# EAGLE design ver11 (EAGLE 6.4)
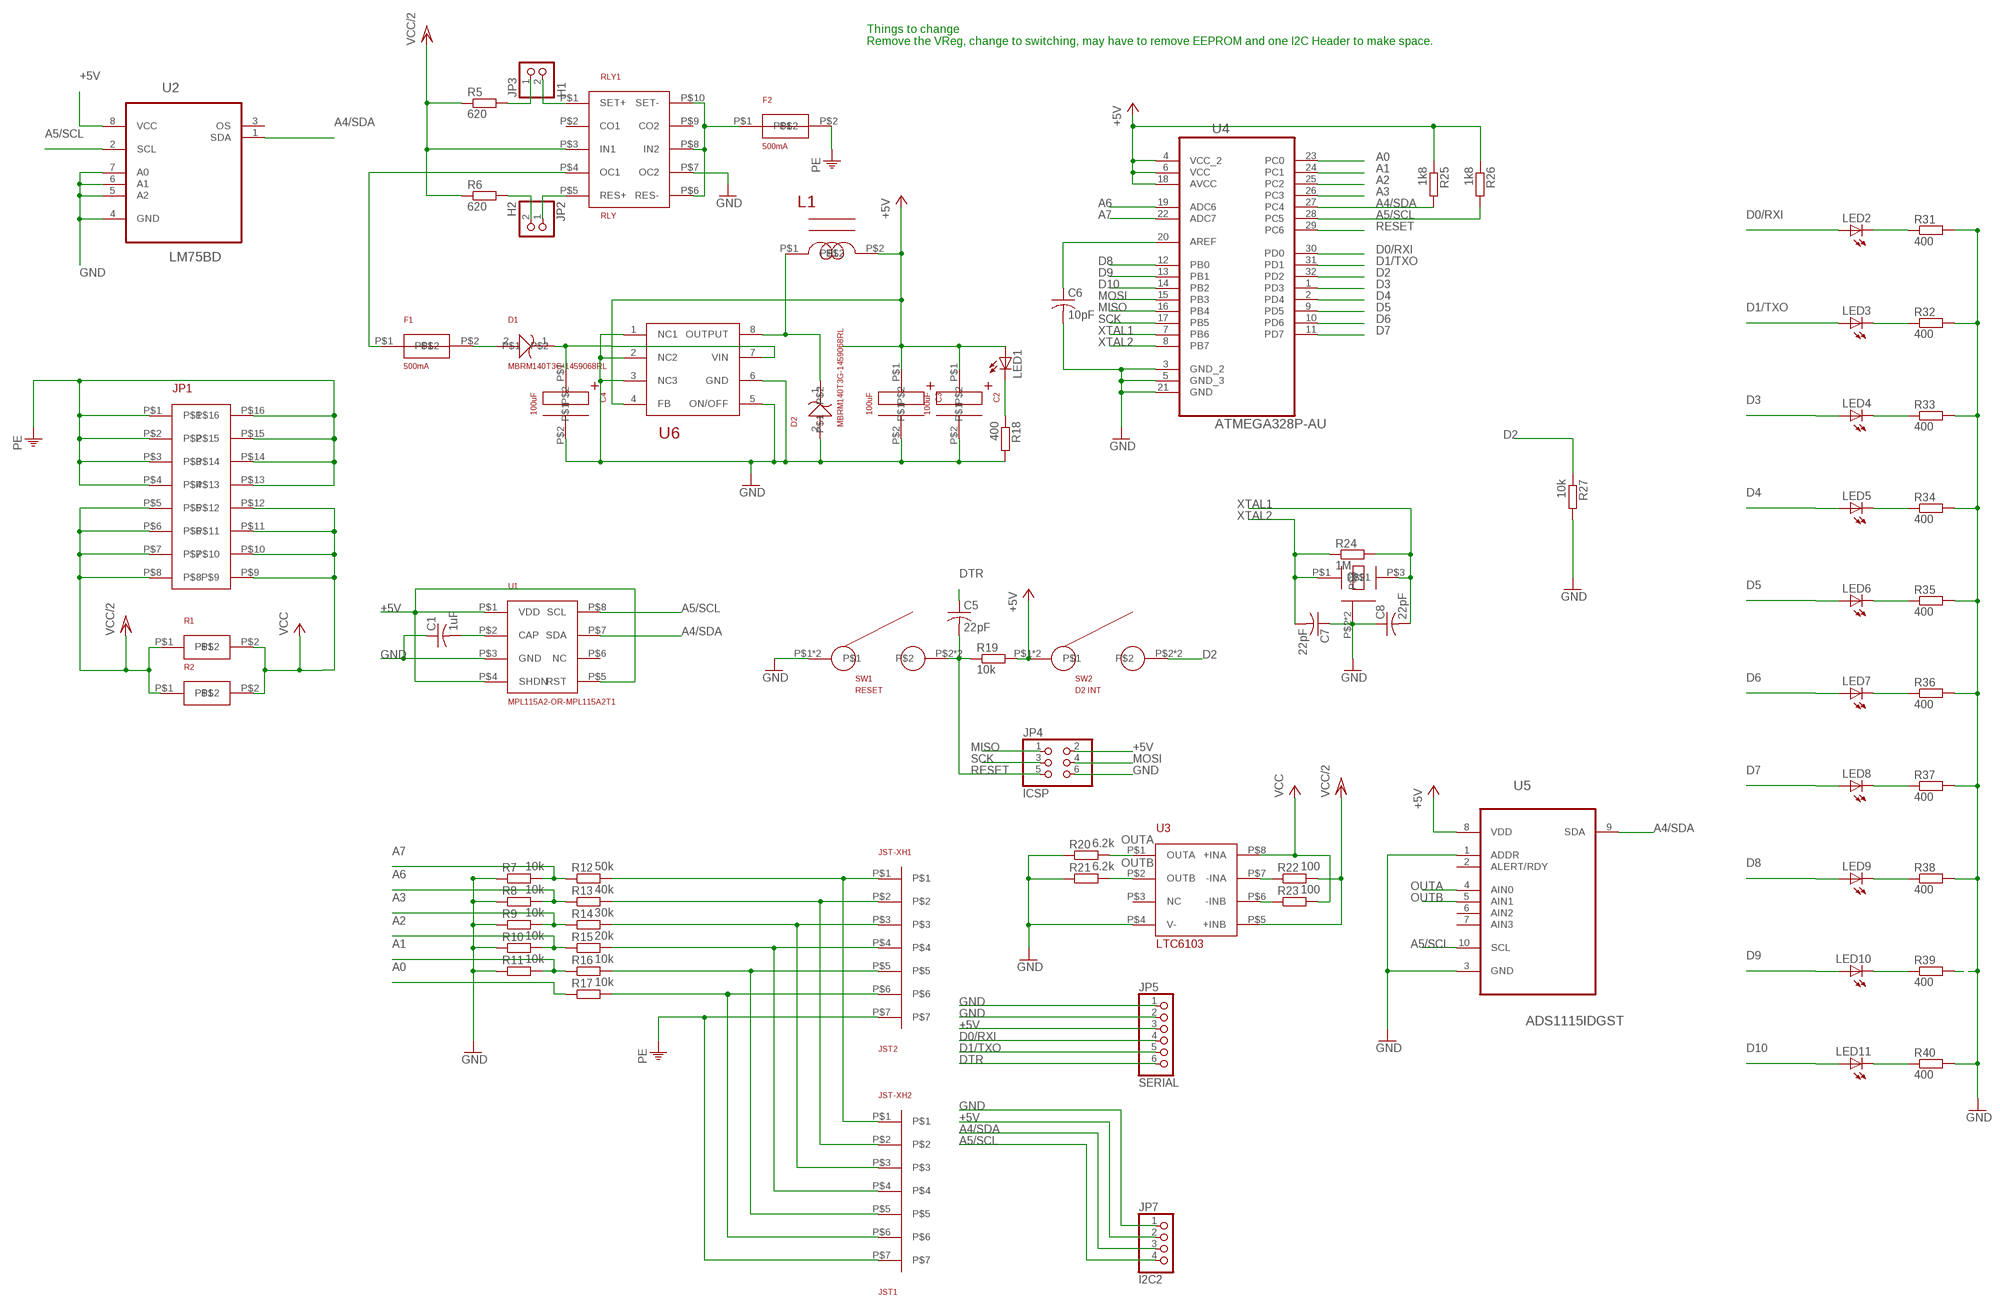
[diagram p0: schematic, sheet 1]

## Parts
C1  1uF  C-USC1206  [C1206]
C2  100uF  EEEFTH101XAP  [EEEFTH101XAP]
C3  100uF  EEEFTH101XAP  [EEEFTH101XAP]
C4  100uF  EEEFTH101XAP  [EEEFTH101XAP]
C5  22pF  C-USC1206  [C1206]
C6  10pF  C-USC1206  [C1206]
C7  22pF  C-USC1206  [C1206]
C8  22pF  C-USC1206  [C1206]
D1  MBRM140T3G-1459068RL  [MBRM140T3G-1459068RL]
D2  MBRM140T3G-1459068RL  [MBRM140T3G-1459068RL]
F1  500mA  MF-MSMF050-2  [MF-MSMF050-2]
F2  500mA  0154.500DR-FUSE-0453.500  [0154.500DR-FUSE-0453.500]
JP1  39-29-1167-MOLEX  [39-29-1167-MOLEX]
JP2  H2  PINHD-1X2  [1X02]
JP3  H1  PINHD-1X2  [1X02]
JP4  ICSP  PINHD-2X3  [2X03]
JP5  SERIAL  PINHD-1X6  [1X06]
JP7  I2C2  PINHD-1X4  [1X04]
JST-XH1  JST2  JSTXH-7PIN  [JSTXH-7PIN]
JST-XH2  JST1  JSTXH-7PIN  [JSTXH-7PIN]
L1  MCSD75-121KU-120UF-INDUCTOR-660MA-1864147  [MCSD75-121KU-120UF-INDUCTOR-660MA-1864147]
LED1  LED1206  [LED-1206]
LED2  LED1206  [LED-1206]
LED3  LED1206  [LED-1206]
LED4  LED1206  [LED-1206]
LED5  LED1206  [LED-1206]
LED6  LED1206  [LED-1206]
LED7  LED1206  [LED-1206]
LED8  LED1206  [LED-1206]
LED9  LED1206  [LED-1206]
LED10  LED1206  [LED-1206]
LED11  LED1206  [LED-1206]
R1  OARSXPR002FLF  [OARSXPR002FLF]
R2  OARSXPR002FLF  [OARSXPR002FLF]
R5  620  R-EU_R1206  [R1206]
R6  620  R-EU_R1206  [R1206]
R7  10k  R-EU_R1206  [R1206]
R8  10k  R-EU_R1206  [R1206]
R9  10k  R-EU_R1206  [R1206]
R10  10k  R-EU_R1206  [R1206]
R11  10k  R-EU_R1206  [R1206]
R12  50k  R-EU_R1206  [R1206]
R13  40k  R-EU_R1206  [R1206]
R14  30k  R-EU_R1206  [R1206]
R15  20k  R-EU_R1206  [R1206]
R16  10k  R-EU_R1206  [R1206]
R17  10k  R-EU_R1206  [R1206]
R18  400  R-EU_R1206  [R1206]
R19  10k  R-EU_R1206  [R1206]
R20  6.2k  R-EU_R1206  [R1206]
R21  6.2k  R-EU_R1206  [R1206]
R22  100  R-EU_R1206  [R1206]
R23  100  R-EU_R1206  [R1206]
R24  1M  R-EU_R1206  [R1206]
R25  1k8  R-EU_R1206  [R1206]
R26  1k8  R-EU_R1206  [R1206]
R27  10k  R-EU_R1206  [R1206]
R31  400  R-EU_R1206  [R1206]
R32  400  R-EU_R1206  [R1206]
R33  400  R-EU_R1206  [R1206]
R34  400  R-EU_R1206  [R1206]
R35  400  R-EU_R1206  [R1206]
R36  400  R-EU_R1206  [R1206]
R37  400  R-EU_R1206  [R1206]
R38  400  R-EU_R1206  [R1206]
R39  400  R-EU_R1206  [R1206]
R40  400  R-EU_R1206  [R1206]
RLY1  RLY  3-1393788-3  [3-1393788-3]
SW1  RESET  MC32829  [MC32829]
SW2  D2 INT  MC32829  [MC32829]
U1  MPL115A2-OR-MPL115A2T1  [MPL115A2-OR-MPL115A2T1]
U2  LM75BD  [SOIC127P600X175-8N]
U3  LTC6103  LTC6103CMS8#PBF  [LTC6103CMS8#PBF]
U4  ATMEGA328P-AU  [QFP80P900X900X120-32N]
U5  ADS1115IDGST  [SOP50P490X110-10N]
U6  VOLTREG-LM2594MX-5.0/NOPB-1496090  [SO08]
XT1  ABMM2-16.000MHZ-E2-T  [ABMM2-16.000MHZ-E2-T]

## Nets
+5V: C2.P$1 C3.P$1 JP4.2 JP5.3 JP7.2 L1.P$2 LED1.A R19.2 R25.1 R26.1 SW2.P$1 SW2.P$4 U1.P$1(VDD) U1.P$4(SHDN) U1.P$5(RST) U2.8(VCC) U4.4(VCC_2) U4.6(VCC) U4.18(AVCC) U5.8(VDD) U6.4(FB)
A0: R17.1 U4.23(PC0)
A1: R11.2 R16.1 U4.24(PC1)
A2: R10.2 R15.1 U4.25(PC2)
A3: R9.2 R14.1 U4.26(PC3)
A4/SDA: JP7.3 R25.2 U1.P$7(SDA) U2.1(SDA) U4.27(PC4) U5.9(SDA)
A5/SCL: JP7.4 R26.2 U1.P$8(SCL) U2.2(SCL) U4.28(PC5) U5.10(SCL)
A6: R8.2 R13.1 U4.19(ADC6)
A7: R7.2 R12.1 U4.22(ADC7)
D0/RXI: JP5.4 LED2.A U4.30(PD0)
D1/TXO: JP5.5 LED3.A U4.31(PD1)
D2: R27.1 SW2.P$2 SW2.P$3 U4.32(PD2)
D3: LED4.A U4.1(PD3)
D4: LED5.A U4.2(PD4)
D5: LED6.A U4.9(PD5)
D6: LED7.A U4.10(PD6)
D7: LED8.A U4.11(PD7)
D8: LED9.A U4.12(PB0)
D9: LED10.A U4.13(PB1)
D10: LED11.A U4.14(PB2)
DTR: C5.1 JP5.6
GND: C1.1 C2.P$2 C3.P$2 C4.P$2 C6.2 C7.1 C8.1 D2.2 JP4.6 JP5.1 JP5.2 JP7.1 R7.1 R8.1 R9.1 R10.1 R11.1 R18.2 R20.1 R21.1 R27.2 R31.2 R32.2 R33.2 R34.2 R35.2 R36.2 R37.2 R38.2 R39.2 R40.2 RLY1.P$7(OC2) SW1.P$1 SW1.P$4 U1.P$3(GND) U2.4(GND) U2.5(A2) U2.6(A1) U2.7(A0) U3.P$4(V-) U4.3(GND_2) U4.5(GND_3) U4.21(GND) U5.1(ADDR) U5.3(GND) U6.1(NC1) U6.2(NC2) U6.3(NC3) U6.5(ON/OFF) U6.6(GND) XT1.P$2 XT1.P$4
MISO: JP4.1 U4.16(PB4)
MOSI: JP4.4 U4.15(PB3)
N$1: F1.P$1 RLY1.P$4(OC1)
N$2: C4.P$1 D1.1 U6.7(VIN)
N$3: D1.2 F1.P$2
N$4: LED1.C R18.1
N$5: JP3.1 R5.2
N$6: JP3.2 RLY1.P$1(SET+)
N$7: LED2.C R31.1
N$9: LED3.C R32.1
N$10: LED4.C R33.1
N$11: LED5.C R34.1
N$12: LED6.C R35.1
N$13: LED7.C R36.1
N$14: LED8.C R37.1
N$15: LED9.C R38.1
N$16: LED10.C R39.1
N$17: LED11.C R40.1
N$18: JST-XH1.P$1 JST-XH2.P$1 R12.2
N$19: JST-XH1.P$2 JST-XH2.P$2 R13.2
N$20: JST-XH1.P$3 JST-XH2.P$3 R14.2
N$21: JST-XH1.P$4 JST-XH2.P$4 R15.2
N$22: JST-XH1.P$5 JST-XH2.P$5 R16.2
N$23: JST-XH1.P$6 JST-XH2.P$6 R17.2
N$24: JP2.2 R6.2
N$25: C6.1 U4.20(AREF)
N$26: F2.P$1 RLY1.P$6(RES-) RLY1.P$8(IN2) RLY1.P$10(SET-)
N$27: JP2.1 RLY1.P$5(RES+)
N$28: D2.1 L1.P$1 U6.8(OUTPUT)
N$29: R22.1 U3.P$7(-INA)
N$30: R23.1 U3.P$6(-INB)
N$32: C1.2 U1.P$2(CAP)
OUTA: R20.2 U3.P$1(OUTA) U5.4(AIN0)
OUTB: R21.2 U3.P$2(OUTB) U5.5(AIN1)
PE: F2.P$2 JP1.P$1 JP1.P$2 JP1.P$3 JP1.P$4 JP1.P$13 JP1.P$14 JP1.P$15 JP1.P$16 JST-XH1.P$7 JST-XH2.P$7
RESET: C5.2 JP4.5 R19.1 SW1.P$2 SW1.P$3 U4.29(PC6)
SCK: JP4.3 U4.17(PB5)
VCC: JP1.P$9 JP1.P$10 JP1.P$11 JP1.P$12 R1.P$2 R2.P$2 R23.2 U3.P$8(+INA)
VCC/2: JP1.P$5 JP1.P$6 JP1.P$7 JP1.P$8 R1.P$1 R2.P$1 R5.1 R6.1 R22.2 RLY1.P$3(IN1) U3.P$5(+INB)
XTAL1: C8.2 R24.2 U4.7(PB6) XT1.P$3
XTAL2: C7.2 R24.1 U4.8(PB7) XT1.P$1
Unconnected: RLY1.P$2(CO1) RLY1.P$9(CO2) U1.P$6(NC) U2.3(OS) U3.P$3(NC) U5.2(ALERT/RDY) U5.6(AIN2) U5.7(AIN3)

## Notes on the sheet
- Things to change
  Remove the VReg, change to switching, may have to remove EEPROM and one I2C Header to make space.

## Library data of the parts
C1 C5-C8 = resistor:C-US: CAPACITOR, American symbol
C2-C4 = ver7:EEEFTH101XAP
D1 D2 = ver7:MBRM140T3G-1459068RL
F1 = ver7:MF-MSMF050-2
F2 = ver7:0154.500DR-FUSE-0453.500
JP1 = ver4:39-29-1167-MOLEX
JP2 JP3 = pinhead:PINHD-1X2: PIN HEADER
JP4 = pinhead:PINHD-2X3: PIN HEADER
JP5 = pinhead:PINHD-1X6: PIN HEADER
JP7 = pinhead:PINHD-1X4: PIN HEADER
JST-XH1 JST-XH2 = ver4:JSTXH-7PIN: Just a 7 Pin connector for JST Purposes
L1 = ver7:MCSD75-121KU-120UF-INDUCTOR-660MA-1864147
LED1-LED11 = SparkFun-LED:LED: LEDs Standard schematic elements and footprints for 5mm, 3mm, 1206, and 0603 sized LEDs. 5mm - Spark Fun Electronics SKU : COM-00529 (and others)
R1 R2 = ver7:OARSXPR002FLF
R5-R27 R31-R40 = resistor:R-EU_: RESISTOR, European symbol
RLY1 = ver4:3-1393788-3
SW1 SW2 = ver4:MC32829
U1 = ver7:MPL115A2-OR-MPL115A2T1
U2 = ver7:LM75BD: Digital temperature sensor and thermal watchdog; MPN: LM75BD; OC_FARNELL: 1854077; OC_NEWARK: 39T1312; PACKAGE: SO-8; SUPPLIER: NXP
U3 = ver7:LTC6103CMS8#PBF
U4 = Atmel_By_element14_Batch_1:ATMEGA328P-AU: 8-bit Microcontroller with In-System Programmable Flash; MPN: ATMEGA328P-AU; OC_FARNELL: 1715486; OC_NEWARK: 14R4631; PACKAGE: TQFP-32; SUPPLIER: Atmel
U5 = ver7:ADS1115IDGST: Analog-to-Digital Converter with Internal Reference; MPN: ADS1115IDGST; OC_FARNELL: 1762981; OC_NEWARK: 25R1241; PACKAGE: MSOP-10; SUPPLIER: Texas Instruments
U6 = ver5-smd-ipc:VOLTREG-LM2594MX-5.0/NOPB-1496090
XT1 = ver7:ABMM2-16.000MHZ-E2-T

## Net classes
0 default: width 0.254 mm, clearance 0.203 mm

## Board
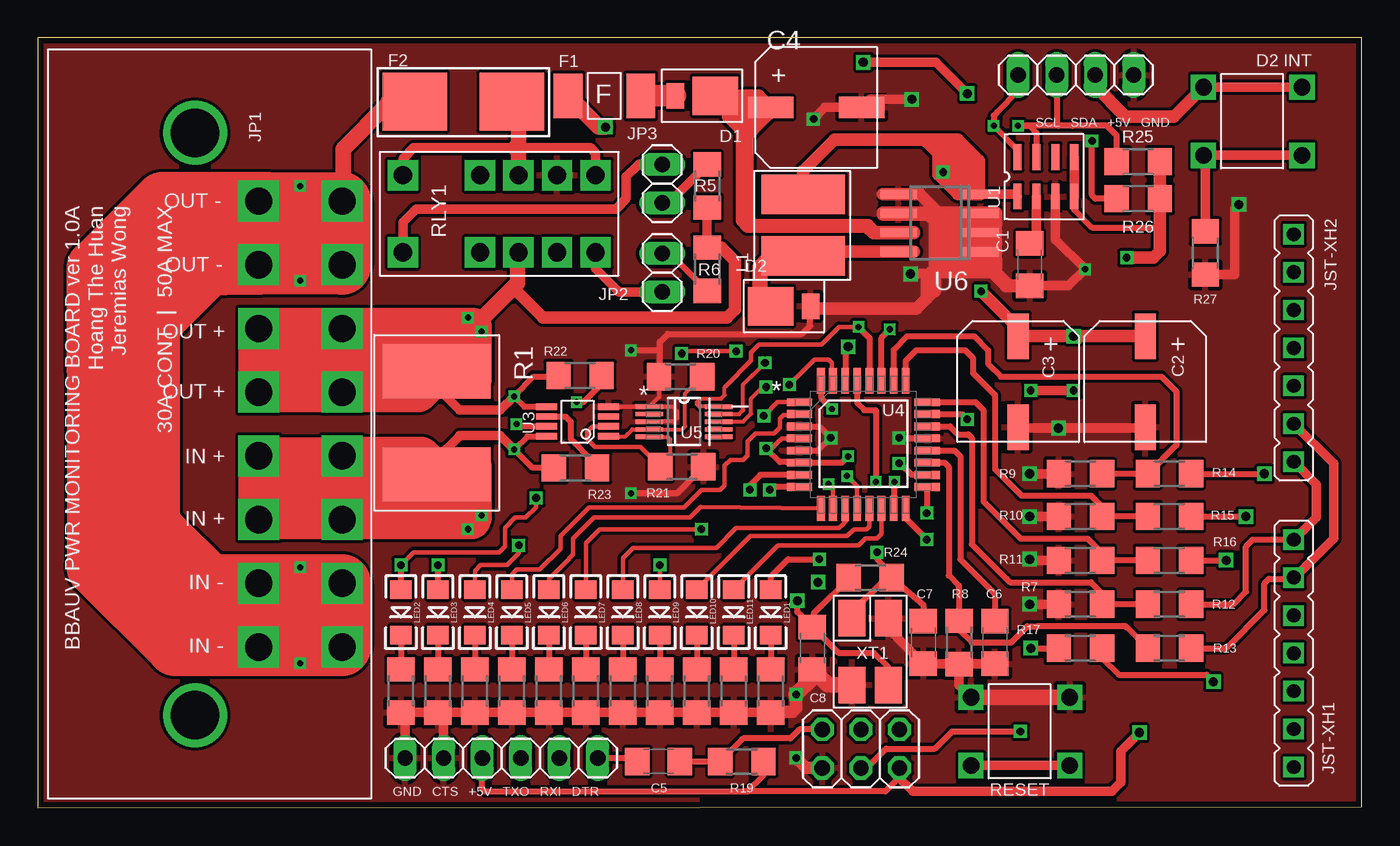
[diagram p1: board, top side]
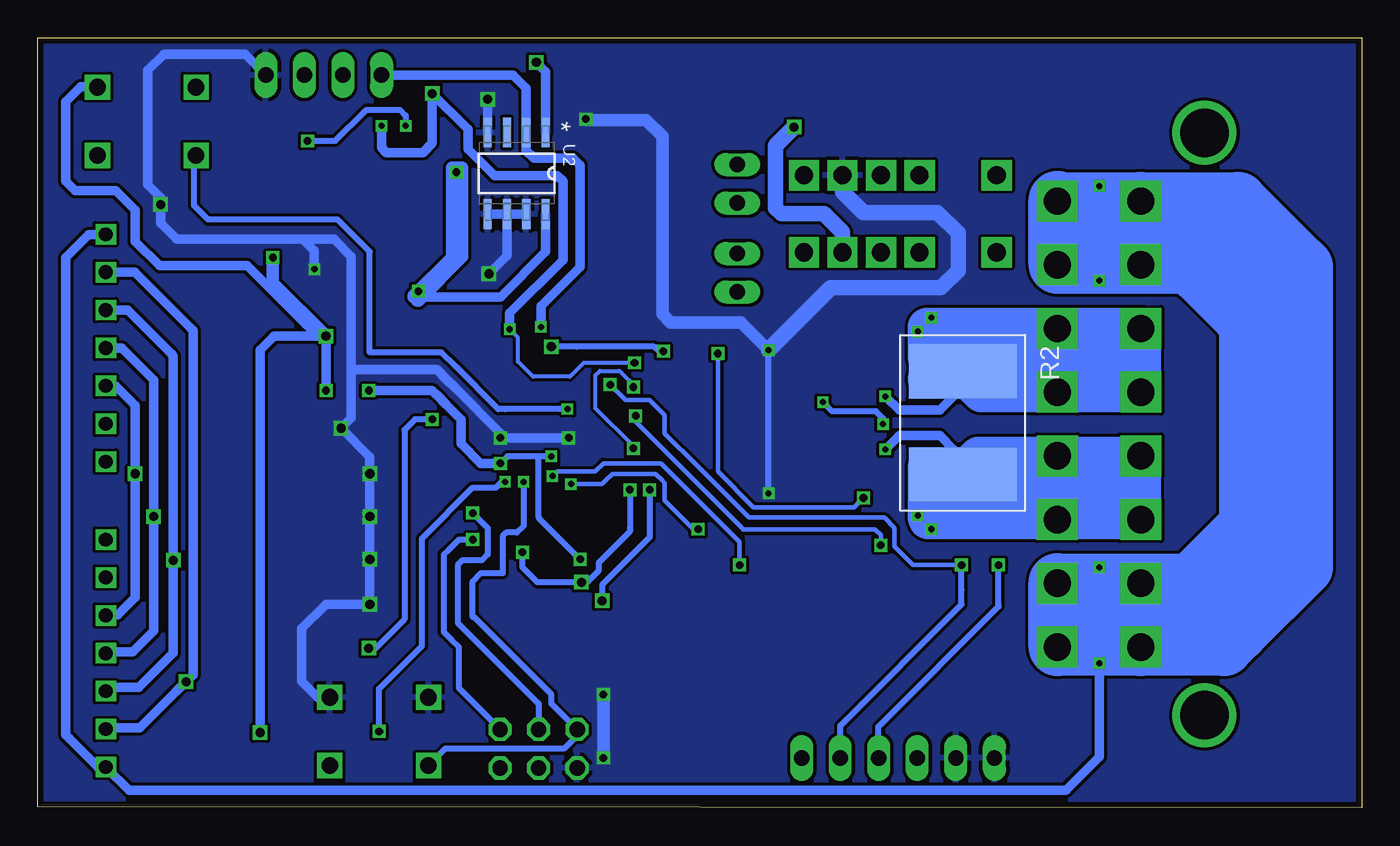
[diagram p2: board, bottom side, seen from below]

Size 87.26 x 50.76 mm. Coordinates in mm from the lower left corner, seen from the top.
Outline: 0,0 87.26,0.08 87.26,50.76 0,50.76 0,0
Copper layers (1*16): Top 0.0356mm / dielectric 1.5011mm / Bottom 0.0356mm
Design rules "LaenPCBOrder": minimum track width 6mil, minimum drill 13mil, track to track 6mil, track to pad 6mil, pad to pad 6mil, via to via 6mil, smd to smd 6mil, copper to edge 15mil, drill to drill 6mil, minimum pad ring 7mil, minimum via ring 7mil, stop-mask expansion 3mil, vias tented up to drill 0mil, thermal gap 10mil

### Footprints (pad centres in the part's own frame; a part is rotated, then mirrored left to right if it is on the bottom)
C1206 = smd 1.6 x 1.8: 1 -1.4,0; 2 1.4,0
EEEFTH101XAP = smd 3 x 1.4: P$1 -1,0; P$2 5,0
MBRM140T3G-1459068RL = smd 2.97 x 2.54: 1 0,0 | smd 1.162 x 1.67: 2 2.631,0
MF-MSMF050-2 = smd 1.88 x 2.95: P$1 -2.39,0; P$2 2.39,0
0154.500DR-FUSE-0453.500 = smd 4.24 x 3.81: P$1 -3.19,0; P$2 3.19,0
39-29-1167-MOLEX = drill 1.8 square: P$1 -14.7,5.5; P$2 -14.7,0; P$3 -10.5,5.5; P$4 -10.5,0; P$5 -6.3,5.5; P$6 -6.3,0; P$7 -2.1,5.5; P$8 -2.1,0; P$9 2.1,5.5; P$10 2.1,0; P$11 6.3,5.5; P$12 6.3,0; P$13 10.5,5.5; P$14 10.5,0; P$15 14.7,5.5; P$16 14.7,0 | drill 3.2 pad 4.2: P$17 -19.2,-4.2; P$18 19.2,-4.2
1X02 = drill 1.016 long: 1 -1.27,0; 2 1.27,0
2X03 = drill 1.016 octagon: 1 -2.54,-1.27; 2 -2.54,1.27; 3 0,-1.27; 4 0,1.27; 5 2.54,-1.27; 6 2.54,1.27
1X06 = drill 1.016 long: 1 -6.35,0; 2 -3.81,0; 3 -1.27,0; 4 1.27,0; 5 3.81,0; 6 6.35,0
1X04 = drill 1.016 long: 1 -3.81,0; 2 -1.27,0; 3 1.27,0; 4 3.81,0
JSTXH-7PIN = drill 0.9 square: P$1 0,0; P$2 2.5,0; P$3 5,0; P$4 7.5,0; P$5 10,0; P$6 12.5,0; P$7 15,0
MCSD75-121KU-120UF-INDUCTOR-660MA-1864147 = smd 2.6 x 5.5: P$1 -2.025,0; P$2 2.025,0
LED-1206 = smd 1.2 x 1.4: A -1.5,0; C 1.5,0
OARSXPR002FLF = smd 3.58 x 7.11: P$1 -3.4,0; P$2 3.4,0
R1206 = smd 1.6 x 1.803: 1 -1.422,0; 2 1.422,0
3-1393788-3 = drill 1.2 pad 2 square: P$1 0,-2.54; P$2 5.08,-2.54; P$3 7.62,-2.54; P$4 10.16,-2.54; P$5 12.7,-2.54; P$6 12.7,2.54; P$7 10.16,2.54; P$8 7.62,2.54; P$9 5.08,2.54; P$10 0,2.54
MC32829 = drill 1.1 square: P$1 -3.25,-2.25; P$2 -3.25,2.25; P$3 3.25,2.25; P$4 3.25,-2.25
MPL115A2-OR-MPL115A2T1 = smd 1.7 x 0.55: P$1 -1.3,1.875; P$2 -1.3,0.625; P$3 -1.3,-0.625; P$4 -1.3,-1.875; P$5 1.3,-1.875; P$6 1.3,-0.625; P$7 1.3,0.625; P$8 1.3,1.875
SOIC127P600X175-8N = smd 1.952 x 0.533: 1 -2.691,1.905; 2 -2.691,0.635; 3 -2.691,-0.635; 4 -2.691,-1.905; 5 2.691,-1.905; 6 2.691,-0.635; 7 2.691,0.635; 8 2.691,1.905
LTC6103CMS8#PBF = smd 1.4 x 0.42: P$1 -4.089,1.95; P$2 -4.089,1.3; P$3 -4.089,0.65; P$4 -4.089,0; P$5 0,0; P$6 0,0.65; P$7 0,1.3; P$8 0,1.95
QFP80P900X900X120-32N = smd 1.673 x 0.508: 1 -4.215,2.794; 2 -4.215,2.007; 3 -4.215,1.194; 4 -4.215,0.406; 5 -4.215,-0.406; 6 -4.215,-1.194; 7 -4.215,-2.007; 8 -4.215,-2.794; 17 4.215,-2.794; 18 4.215,-2.007; 19 4.215,-1.194; 20 4.215,-0.406; 21 4.215,0.406; 22 4.215,1.194; 23 4.215,2.007; 24 4.215,2.794 | smd 0.508 x 1.673: 9 -2.794,-4.215; 10 -2.007,-4.215; 11 -1.194,-4.215; 12 -0.406,-4.215; 13 0.406,-4.215; 14 1.194,-4.215; 15 2.007,-4.215; 16 2.794,-4.215; 25 2.794,4.215; 26 2.007,4.215; 27 1.194,4.215; 28 0.406,4.215; 29 -0.406,4.215; 30 -1.194,4.215; 31 -2.007,4.215; 32 -2.794,4.215
SOP50P490X110-10N = smd 1.822 x 0.279: 1 -2.284,0.991; 2 -2.284,0.508; 3 -2.284,0; 4 -2.284,-0.508; 5 -2.284,-0.991; 6 2.284,-0.991; 7 2.284,-0.508; 8 2.284,0; 9 2.284,0.508; 10 2.284,0.991
SO08 = smd 0.6 x 2.4: 1 -1.905,-2.7; 2 -0.635,-2.7; 3 0.635,-2.7; 4 1.905,-2.7; 5 1.905,2.7; 6 0.635,2.7; 7 -0.635,2.7; 8 -1.905,2.7
ABMM2-16.000MHZ-E2-T = smd 2.4 x 1.8: P$1 -2.2,-1.2; P$2 2.2,-1.2; P$3 2.2,1.2; P$4 -2.2,1.2

### Placement (x,y rotation side)
C1  65.38,35.81 90 top
C2  73,30.1 270 top
C3  64.62,30.1 270 top
C4  49.3,46.18 0 top
C5  40.92,3.05 0 top
C6  63.09,10.9 270 top
C7  58.37,10.9 90 top
C8  51.05,10.52 90 top
D1  44.65,46.94 180 top
D2  48.31,33.07 0 top
F1  37.34,46.94 0 top
F2  28.04,46.56 180 top
JP1  14.55,25.3 270 top
JP2  41.15,35.28 90 top
JP3  41.15,41.15 90 top
JP4  54.25,3.89 180 top
JP5  30.56,3.28 0 top
JP7  68.43,48.31 180 top
JST-XH1  82.79,17.68 270 top
JST-XH2  82.79,22.81 90 top
L1  50.44,38.4 90 top
LED1  48.31,12.88 270 top
LED2  23.93,12.88 270 top
LED3  26.37,12.88 270 top
LED4  28.8,12.88 270 top
LED5  31.24,12.88 270 top
LED6  33.68,12.88 270 top
LED7  36.12,12.88 270 top
LED8  38.56,12.88 270 top
LED9  41,12.88 270 top
LED10  43.43,12.88 270 top
LED11  45.87,12.88 270 top
R1  26.29,25.37 270 top
R2  26.29,25.37 270 bottom
R5  44.12,41 90 top
R6  44.12,35.51 270 top
R7  68.73,13.41 0 top
R8  60.73,10.9 90 top
R9  68.73,22.02 0 top
R10  68.73,19.2 0 top
R11  68.73,16.31 0 top
R12  74.6,13.41 0 top
R13  74.6,10.52 0 top
R14  74.6,22.02 0 top
R15  74.6,19.2 0 top
R16  74.6,16.31 0 top
R17  68.73,10.52 0 top
R18  48.31,7.7 270 top
R19  46.41,3.05 0 top
R20  42.37,28.42 0 top
R21  42.44,22.48 180 top
R22  35.74,28.5 180 top
R23  35.43,22.4 180 top
R24  54.86,15.16 180 top
R25  72.54,42.6 180 top
R26  72.54,40.16 180 top
R27  76.96,36.58 270 top
R31  23.93,7.7 270 top
R32  26.37,7.7 270 top
R33  28.8,7.7 270 top
R34  31.24,7.7 270 top
R35  33.68,7.7 270 top
R36  36.12,7.7 270 top
R37  38.56,7.7 270 top
R38  41,7.7 270 top
R39  43.43,7.7 270 top
R40  45.87,7.7 270 top
RLY1  24.06,39.16 0 top
SW1  64.77,5.03 180 top
SW2  80.09,45.26 180 top
U1  66.45,41.61 90 top
U2  55.7,41.83 270 bottom
U3  33.53,26.44 180 top
U4  54.42,23.95 0 top
U5  42.6,25.45 0 top
U6  59.44,38.56 90 top
XT1  54.86,10.29 270 top

### Tracks (layer width: path | path; a pad name or v marks a point on that pad's centre or on a via)
+5V  (via drill 0.4, 0.5, 0.6)
  Top 0.254: U5.8 46.48,25.45 47.02,25.98 47.02,26.97 47.78,27.74 v48.01,27.74 47.78,27.51
  Top 0.305: v48.01,23.7 48.39,23.7 48.77,24.08 49.04,24.35 49.5,24.35
  Top 0.406: JP5.3 29.26,3.25 29.26,1.3 29.49,1.07 39.62,1.07 46.48,1.07 | 46.48,1.07 46.79,1.07 47.83,2.11 R19.2 | 46.48,1.07 55.85,1.07 55.93,1.14 56.77,1.98 56.77,2.59 JP4.2 | U4.4 49.5,24.35 | 58.52,21.95 U4.18 58.52,21.95 | 58.52,21.95 57.61,21.95 56.84,22.71 v56.77,22.71 | v53.42,23.16 53,22.75 U4.6 50.27,22.78 49.38,22.78 48.92,22.78 v48.01,23.7 | LED1.A 48.31,15.24 49.45,16.38 v51.51,16.38 | U1.P$5 68.32,39.43 69.49,38.25 73.96,38.25
  Top 0.61: U1.P$5 U1.P$4 | SW2.P$4 SW2.P$1 | v68.27,31.1 v68.27,31.09 | v72.62,4.95 71.4,3.73 71.4,1.68 70.79,1.07 57.68,1.07 56.77,1.98 | v65.46,27.51 68.12,27.51 68.2,27.51 v68.27,27.51 | 62.03,40.47 64.44,40.47 U1.P$1 | C2.P$1 72.99,31.09
  Top 0.813: v68.27,31.1 C3.P$1 64.46,31.25 64.46,31.78 v62.18,34.06 | L1.P$2 50.44,41.99 52.5,44.04 60.65,44.04 62.03,42.67 62.03,40.47 U6.4 61.11,40.46 60.65,40.46 59.36,41.76 59.36,43.13 58.6,43.89 59.28,43.89 59.97,43.21 59.97,41.68 60.81,40.84 61.34,40.84 61.49,41 61.49,42.37 60.35,43.51 60.35,41.91 60.88,41.38 60.88,42.14 60.65,42.37 v59.66,41.91 | R25.1 R26.1 73.96,38.25 73.96,36.78 73.96,36.7 73.53,36.27 v71.78,36.27 | 72.99,31.09 v68.27,31.09 | JP7.2 69.7,47.57 71.7,45.57 74.89,45.57 SW2.P$4
  Bottom 0.254: v48.01,27.74 48.01,27.89 48.69,28.57 48.77,28.65 48.92,28.8 50.22,28.8 50.52,28.5 50.52,26.36 48.01,23.85 v48.01,23.7
  Bottom 0.406: v53.42,23.16 54.33,23.16 | 54.33,23.16 56.31,23.16 v56.77,22.71 | v51.51,16.38 54.18,19.05 54.25,19.13 54.25,23.09 54.33,23.16
  Bottom 0.61: SW2.P$1 83.37,47.55 84.43,47.55 85.42,46.56 85.42,41.3 84.81,40.69 82.14,40.69 80.85,39.4 80.85,37.34 79.25,35.74 73.46,35.74 71.17,33.45 69.58,31.86 68.81,31.09 v68.27,31.09 | v72.62,4.95 72.62,30.17 71.78,31.01 71.7,31.09 v68.27,31.09 | v56.77,22.71 58.06,22.71 59.36,24 59.36,25.6 60.35,26.59 60.96,27.2 61.04,27.28 61.11,27.36 61.26,27.51 v65.46,27.51 | v68.27,27.51 v68.27,31.09 | U2.8 53.8,36.65 56.77,33.68 61.8,33.68 v62.18,34.06
  Bottom 0.813: v59.66,41.91 59.36,41.91 59.97,41.91 59.97,36.27 62.48,33.76 62.26,33.53 59.59,36.19 59.59,42.14 59.51,42.21 | 59.51,42.21 59.97,42.21 59.97,40.77 59.82,40.61 59.82,41.91 59.51,42.21 | 59.51,42.21 59.28,42.21 59.28,36.35 62.18,33.45 62.26,33.45 62.48,33.68 59.66,36.58 v62.18,34.06 | v71.78,36.27 71.78,34.59 v68.27,31.09
A0  (via drill 0.5, 0.6)
  Top 0.406: U4.23 60.91,25.95 v61.26,25.6 | v65.46,10.52 R17.1
  Bottom 0.406: v61.26,25.6 62.41,25.6 63.09,24.92 63.09,12.42 65,10.52 v65.46,10.52
A1
  Top 0.406: R16.1 R11.2 70.1,16.36 70.1,16.84 69.19,17.75 64.77,17.75 64.69,17.83 62.33,20.19 62.33,21.03 62.33,26.21 61.8,26.74 U4.24
A2
  Top 0.406: R15.1 R10.2 70.1,19.25 70.1,19.89 69.42,20.57 64.85,20.57 64.77,20.65 64.69,20.73 63.09,22.33 63.09,27.2 61.65,28.65 61.65,29.64 61.11,30.17 57.91,30.17 57.21,29.47 U4.25
A3
  Top 0.406: R9.2 R14.1 75.06,23.9 75.06,27.43 74.07,28.42 63.47,28.42 62.64,29.26 62.64,30.17 61.72,31.09 57.3,31.09 56.42,30.21 U4.26
A4/SDA  (via drill 0.4, 0.5, 0.6)
  Top 0.254: v47.93,29.34 47.09,28.5 47.02,28.42 46.48,27.89 46.48,26.21 46.23,25.96 U5.9
  Top 0.406: U4.27 55.61,31 v56.16,31.55 | U1.P$7 65.84,42.62 65.84,44.5 65.38,44.96 v64.62,44.96 67.28,44.96 | R25.2 71.12,44.32 70.48,44.96 68.2,44.96 67.28,44.96 | JP7.3 67.16,45.08 67.28,44.96
  Top 0.61: v54.41,49.15 59.21,49.15 v61.26,47.09
  Bottom 0.254: v56.16,31.55 55.61,31 55.61,29.41 54.62,28.42 52.2,28.42 51.82,28.8 51.28,29.34 v47.93,29.34
  Bottom 0.61: U2.1 53.8,48.54 v54.41,49.15 | v64.62,44.96 64.62,43.51 64.31,43.21 61.87,43.21 61.26,43.81 v61.26,47.09 58.9,44.73 58.9,43.43 57.15,41.68 53.03,41.68 52.65,41.3 52.65,36.12 56.16,32.61 v56.16,31.55
A5/SCL  (via drill 0.4, 0.5)
  Top 0.254: U5.10 43.59,26.44 43.43,26.59 43.43,26.75 43.66,26.97 45.03,26.97 45.26,27.2 45.26,27.74 45.31,27.79
  Top 0.305: 54.03,31.78 v54.1,31.7 52.81,31.7 51.66,30.56 50.37,30.56 48.08,30.56 47.55,30.56 47.02,30.02 47.02,29.49 45.31,27.79
  Top 0.406: v54.1,31.7 54.82,30.98 U4.28 | U1.P$8 64.57,43.4 v63.02,44.96 63.02,45.64 63.25,45.87 64.62,47.24 JP7.4 | R26.2 69.72,40.16 69.49,40.39 v69.49,43.97
  Bottom 0.254: 54.25,31.55 v54.1,31.7
  Bottom 0.406: 54.25,31.55 v54.1,31.7 | v69.49,43.97 67.67,43.97 65.76,45.87 65.61,46.02 63.4,46.02 63.02,45.64 v63.02,44.96
  Bottom 0.61: JP7.4 55.93,48.31 55.07,47.45 U2.2 55.07,43.33 54.56,42.82 51.97,42.82 51.51,42.37 51.51,35.66 54.1,33.07 v54.1,31.7
A6
  Top 0.406: R13.1 73.15,10.52 71.78,11.89 71.7,11.96 65.91,11.96 65.23,11.96 64.16,10.9 61.57,10.9 60.73,11.73 R8.2 60.73,14.48 60.73,14.63 60.05,15.32 60.05,22.48 59.77,22.75 59.62,22.75 59.54,22.75 U4.19
A7
  Top 0.406: R12.1 R7.2 70.18,13.44 70.18,14.1 69.42,14.86 64.08,14.86 64.01,14.93 63.86,15.09 61.57,17.37 61.57,24.38 61.34,24.61 60.65,24.61 60.13,25.14 U4.22
D0/RXI  (via drill 0.5, 0.6)
  Top 0.305: v46.02,30.1 42.6,30.1 v42.44,29.95 | v32.84,20.42 32.84,19.81 32.16,19.13 31.47,19.13 30.78,18.44 30.78,17.22 30.4,16.84 24.76,16.84 v23.93,16
  Top 0.406: LED2.A v23.93,16 | v53.42,30.4 53.22,30.21 U4.30
  Bottom 0.305: v42.44,29.95 42.44,22.17 40.08,19.81 33.45,19.81 v32.84,20.42
  Bottom 0.406: JP5.4 31.85,3.3 31.85,5.33 23.93,13.26 23.93,13.41 v23.93,16 | v46.02,30.1 46.33,30.1 46.63,30.4 51.74,30.4 v53.42,30.4
D1/TXO  (via drill 0.5)
  Top 0.305: v49.53,27.89 51.13,29.49 51.21,29.57 51.31,29.57 51.82,29.57 52.12,29.57 52.35,29.34 52.35,28.22 U4.31
  Top 0.406: LED3.A v26.36,16
  Bottom 0.305: v49.53,27.89 48.84,27.2 48.54,26.9 46.94,26.9 45.95,25.91 45.95,24.92 45.95,24.69 43.81,22.55 40.39,19.13 31.47,19.13 30.78,18.44 30.78,17.22 29.57,16 v26.36,16
  Bottom 0.406: JP5.5 34.37,5.41 26.36,13.41 LED3.A v26.36,16
D2  (via drill 0.4)
  Top 0.406: U4.32 51.62,27.02 v52.35,26.29
  Top 0.61: SW2.P$2 SW2.P$3 76.96,42.89 R27.1
  Bottom 0.406: v52.35,26.29 56.46,26.29 56.92,26.29 59.74,29.11 60.65,30.02 65.38,30.02 65.38,36.65 67.51,38.79 76.05,38.79 76.96,39.7 76.96,42.89 SW2.P$3
D3  (via drill 0.5)
  Top 0.305: U4.1 50.3,26.75 49.15,26.75 48.77,26.75 v47.85,25.83 | v31.7,17.3 31.7,16.76 30.94,16 29.18,16 28.8,15.62 LED4.A
  Bottom 0.305: v31.7,17.3 31.7,17.98 32.08,18.36 40.77,18.36 40.84,18.44 45.26,22.86 47.85,25.45 v47.85,25.83
D4
  Top 0.305: LED5.A 31.24,15.39 31.55,15.7 33.07,15.7 34.44,17.07 34.44,17.91 36.35,19.81 42.6,19.81 43.74,20.95 44.96,20.95 45.26,21.26 45.26,22.55 45.64,22.94 45.72,22.94 46.48,22.94 46.79,23.24 46.79,24.16 47.24,24.61 47.32,24.69 48.54,24.69 48.77,24.92 48.92,25.07 48.92,25.45 48.92,25.68 49.15,25.91 50.15,25.91 U4.2
D5
  Top 0.305: U4.9 43.68,19.83 42.98,19.13 36.65,19.13 35.28,17.75 35.28,16.69 34.75,16.15 33.68,15.09 LED6.A
D6  (via drill 0.4, 0.5)
  Top 0.305: LED7.A 36.12,17.45 37.03,18.36 42.9,18.36 v43.74,18.36 | U4.10 52.41,21.2 52.27,21.34 v52.12,21.34
  Bottom 0.305: v43.74,18.36 44.04,18.36 45.95,20.27 45.95,21.41 46.1,21.56 46.56,22.02 49.38,22.02 49.83,21.56 50.06,21.34 v52.12,21.34
D7
  Top 0.305: LED8.A 38.56,16.46 39.09,16.99 39.24,17.14 44.73,17.14 46.02,18.44 46.94,18.44 52.81,18.44 52.88,18.52 52.96,18.59 53.26,18.9 53.26,19.79 U4.11
D8  (via drill 0.4, 0.5)
  Top 0.305: U4.12 54.01,21.2 v53.34,21.87 | v41,16 LED9.A
  Bottom 0.305: v53.34,21.87 53.03,22.17 50.52,22.17 49.99,22.71 46.18,22.71 45.19,21.72 41,17.53 v41,16
D9
  Top 0.305: U4.13 54.82,18.86 54.82,18.55 54.64,18.36 53.8,18.36 53.34,17.91 46.96,17.91 LED10.A
D10
  Top 0.305: U4.14 55.61,18.65 55.61,18.04 55.32,17.75 54.56,17.75 54.1,17.3 53.64,17.3 48.79,17.3 LED11.A
DTR
  Top 0.406: JP5.6 39.29,3.28 arc-90 C5.1
GND  (via drill 0.4, 0.5, 0.6)
  Top 0.254: U3.P$4 U5.1 | R20.1 40.94,27.07 U5.1 | U5.1 41.83,26.44 42.14,26.14 42.14,25.68 41.91,25.45 U5.3
  Top 0.406: U4.3 51.52,25.14 v52.27,24.38 51.43,23.54 U4.5 | U4.21 56.8,24.35 v56.77,24.38 | 41,28.47 41,30.25 | 41,30.25 41,30.71 41.53,31.24 49.68,31.24 50.37,31.24 50.9,31.78 50.9,33.03 D2.2 | R21.1 43.87,22.45 42.14,20.73 v39.09,20.73 | v39.09,30.17 40.92,30.17 41,30.25
  Top 0.61: R9.1 v65.38,22.02 | R10.1 v65.38,19.2 | R7.1 v65.38,13.41 | R11.1 65.46,16.31 v65.38,16.38 | v67.28,25.02 66.67,25.02 | 66.67,25.02 64.69,25.02 C3.P$2 | v67.28,25.02 66.67,25.02 | R32.2 R31.2 24.21,5.99 JP5.1 | R32.2 R33.2 R34.2 R35.2 R36.2 R37.2 R38.2 R39.2 R40.2 R18.2 | JP5.2 26.75,5.89 R32.2 | 41,28.47 R20.1 | XT1.P$4 56.06,11.8 C7.1 60.71,9.5 R8.1 | R8.1 60.73,8.07 SW1.P$4 | R8.1 63.07,9.47 C6.2 | v67.28,25.02 72.92,25.02 C2.P$2 | R27.2 78.89,35.15 78.89,39.5 v79.17,39.78 | U1.P$3 67.07,37.47 v69.04,35.51 67.94,34.41 C1.1 64.01,34.52 65.38,34.52 65.38,34.29 63.78,34.29 64.16,34.44 63.25,35.36 62.79,35.28 63.7,34.37 63.88,34.41 63.09,35.2 59.21,35.2 59.13,35.28 | v51.13,45.41 51.89,46.18 C4.P$2 54.83,46.71 v57.61,46.71 | v57.53,35.2 58.67,35.2 59.13,35.66
  Top 0.813: U6.6 58.57,39.19 58.6,39.17 | 58.6,39.17 59.13,38.63 59.13,37.87 | 59.13,37.87 59.13,36.65 | 59.13,36.65 59.13,35.66 59.13,35.36 59.13,35.28 58.98,35.28 58.6,34.9 58.6,33.6 58.6,34.52 59.13,35.05 59.13,34.06 59.05,34.06 57.91,32.92 51.09,32.92 D2.2 | R18.2 48.36,6.32 49.76,6.32 49.95,6.51 49.99,6.55 v49.99,7.47 | JP4.6 50.65,2.62 50.14,3.12 v49.99,3.28 | U6.3 62.01,39.17 59.36,38.86 59.36,38.94 62.18,38.94 62.18,38.25 59.51,38.25 59.51,38.18 62.33,38.18 62.33,37.19 59.59,37.19 62.03,37.19 62.03,36.19 59.59,36.19 59.59,36.35 62.26,36.35 62.26,35.74 59.51,35.74 59.51,35.59 62.64,35.59 62.79,38.86 62.64,36.12 63.17,35.28 63.17,39.24 62.56,39.24 62.64,39.17 62.64,39.24 59.36,39.24 | 59.36,39.24 58.75,39.24 58.75,39.09 55.7,39.09 55.7,39.24 56.08,39.24 | 56.08,39.24 56.08,39.09 58.52,39.09 58.52,39.24 59.13,39.24 56.08,39.24 | 56.08,39.24 56.84,39.24 56.84,39.17 58.6,39.17 | U6.2 61.98,37.87 59.13,37.87 | U6.1 59.13,36.65 | U6.5 55.7,40.46 58.14,40.46 59.36,39.24
  Top 1.016: XT1.P$2 52.08,8.09 C8.1 51.05,8.53 v49.99,7.47 | SW1.P$4 SW1.P$1
  Bottom 0.406: v56.77,24.38 56.46,24.38 | v39.09,20.73 v39.09,30.17
  Bottom 0.61: 65.38,16.15 v65.38,13.41 68.27,13.41 69.88,11.81 69.88,8.35 68.81,7.28 SW1.P$1 | 65.38,16.15 65.38,16.31 | 65.38,16.61 v65.38,19.2 v65.38,22.02 65.38,23.12 v67.28,25.02 66.6,25.71 66.6,27.66 66.6,28.27 66.6,28.88 | 65.38,16.61 v65.38,16.38 | v65.38,16.38 65.38,16.15 | v65.38,16.38 65.38,16.61 | 69.8,37.49 78.1,37.49 79.17,38.56 79.17,39.47 | 69.8,37.49 67.74,37.49 66.6,36.35 66.6,28.88 | v52.27,24.38 56.46,24.38 v56.77,24.38 56.77,24.69 59.74,27.66 60.35,28.27 60.96,28.88 66.6,28.88 | 79.17,39.47 v79.17,39.78 | v79.17,39.78 79.17,40.23 80.01,41.07 80.01,48.62 78.94,49.68 73.61,49.68 JP7.1 | v79.17,39.78 79.17,39.47 | v69.04,35.51 69.04,36.73 69.8,37.49 | U2.7 U2.6 | U2.6 U2.5 | U2.4 v57.61,46.71 | U2.6 56.34,36.4 v57.53,35.2
  Bottom 0.813: v39.09,30.17 40.92,32 45.41,32 45.57,32 46.1,32.54 46.1,44.27 47.17,45.34 51.05,45.34 v51.13,45.41 | v49.99,3.28 v49.99,7.47
  Bottom 1.016: RLY1.P$7 34.22,40.62 32.84,39.24 27.97,39.24 26.59,37.87 26.59,35.43 27.74,34.29 34.98,34.29 v39.09,30.17
  pour Top: -9.14,49.15 -9.14,51.28 -1.91,58.52 103.02,58.52 107.82,40.31 112.93,0.91 103.1,-8.92 2.74,-8.92 -7.85,1.68 -7.85,48.16 -8.69,49
  pour Bottom: -5.71,47.17 -5.71,47.78 0.53,54.03 101.57,55.63 105.23,41.61 108.43,1.3 102.49,-4.65 2.13,-4.65 -3.35,0.84 -3.35,42.14 -6.17,44.96
MISO  (via drill 0.5)
  Top 0.406: v58.6,17.68 57.21,19.07 U4.16
  Bottom 0.406: JP4.1 59.51,7.87 59.51,10.59 59.97,11.05 60.2,11.28 60.5,11.58 60.5,16.69 60.2,16.99 59.97,17.22 59.51,17.68 v58.6,17.68
MOSI  (via drill 0.4, 0.5)
  Top 0.406: JP4.4 54.66,2.62 55.85,3.81 55.93,3.89 59.13,3.89 60.2,4.95 60.27,5.03 v64.77,5.03 | v56.46,21.49 56.42,21.45 U4.15
  Bottom 0.406: v64.77,5.03 64.77,7.85 61.95,10.67 61.95,17.75 58.6,21.11 57.99,21.11 57.07,21.11 56.69,21.49 v56.46,21.49
N$1  (via drill 0.6)
  Top 1.016: v37.41,44.88 37.01,44.88 F1.P$1
  Bottom 1.016: RLY1.P$4 34.22,37.95 35.43,39.17 38.25,39.17 38.63,39.55 38.63,43.66 v37.41,44.88
N$2
  Top 0.813: D1.1 47.54,46.94 C4.P$1 46.71,45.19 47.24,45.72 48.16,45.72 47.17,44.73 46.79,44.27 46.79,38.71 46.48,39.01 | 46.48,39.01 46.48,44.12 46.71,44.35 46.71,44.73 46.02,46.02 47.4,45.41 47.62,46.41 45.64,46.48 45.57,46.18 45.49,46.25 45.49,45.57 46.41,44.65 46.63,38.86 47.17,38.33 54.71,38.33 55.09,37.95 55.7,37.95 55.63,37.87 55.09,37.87 54.64,38.33 46.79,38.33 46.41,38.71 | 46.41,38.71 46.41,38.94 46.48,39.01 | 46.48,39.01 46.48,44.96 46.41,44.88 46.41,38.71 | 46.41,38.71 46.41,38.86 46.86,38.4 54.71,38.4 55.17,37.95 | 55.17,37.95 55.19,37.92 57.76,37.95 | 57.76,37.95 55.17,37.95 | 55.17,37.95 54.86,38.25 55.24,37.87 57.76,37.87 57.76,37.95 | 57.76,37.95 57.76,37.92 U6.7
N$3
  Top 1.422: F1.P$2 D1.2
N$4
  Top 0.406: LED1.C R18.1
N$5
  Top 0.61: JP3.1 41.58,39.88 R5.2
N$6
  Top 0.61: RLY1.P$1 24.06,38.61 24.76,39.32 24.92,39.47 38.1,39.47 38.79,40.16 38.79,41.6 39.62,42.44 41.12,42.44 JP3.2
N$7
  Top 0.406: LED2.C R31.1
N$9
  Top 0.406: LED3.C R32.1
N$10
  Top 0.406: LED4.C R33.1
N$11
  Top 0.406: LED5.C R34.1
N$12
  Top 0.406: LED6.C R35.1
N$13
  Top 0.406: LED7.C R36.1
N$14
  Top 0.406: LED8.C R37.1
N$15
  Top 0.406: LED9.C R38.1
N$16
  Top 0.406: LED10.C R39.1
N$17
  Top 0.406: LED11.C R40.1
N$18
  Top 0.406: R12.2 78.79,13.41 79.63,14.25 79.63,17.22 80.09,17.68 JST-XH1.P$1
  Top 0.61: JST-XH1.P$1 82.83,17.68 84.28,19.13 84.28,21.33 JST-XH2.P$1
N$19
  Top 0.406: R13.2 78.33,10.52 80.85,13.03 80.85,14.78 81.15,15.09 82.7,15.09 JST-XH1.P$2
  Top 0.61: JST-XH1.P$2 82.85,15.18 85.42,17.75 85.42,22.68 JST-XH2.P$2
N$20  (via drill 0.6)
  Top 0.406: R14.2 v80.85,22.02
  Bottom 0.406: v80.85,22.02 80.85,21.49
  Bottom 0.61: JST-XH2.P$3 82.14,27.81 80.85,26.52 v80.85,22.02 80.85,21.49 80.85,20.27 80.85,19.96 80.85,13.87 81.99,12.73 82.75,12.73 JST-XH1.P$3
N$21  (via drill 0.6)
  Top 0.406: R15.2 v79.63,19.2
  Bottom 0.406: v79.63,19.2 79.63,18.67
  Bottom 0.61: JST-XH2.P$4 81.75,30.31 79.63,28.19 v79.63,19.2 79.63,18.67 79.63,18.14 79.63,17.91 79.63,11.66 81,10.29 82.68,10.29 JST-XH1.P$4
N$22  (via drill 0.6)
  Top 0.406: R16.2 v78.33,16.31
  Bottom 0.406: v78.33,16.31 78.33,16
  Bottom 0.61: JST-XH2.P$5 81.35,32.81 78.49,29.95 78.33,29.79 v78.33,16.31 78.33,16 78.33,15.85 78.33,15.39 78.33,10.21 80.62,7.92 82.55,7.92 JST-XH1.P$5
N$23  (via drill 0.6)
  Top 0.406: R17.2 70.15,9.86 71.25,8.76 77.04,8.76 v77.5,8.31
  Bottom 0.406: v77.5,8.31 78.14,7.66
  Bottom 0.61: JST-XH2.P$6 80.88,35.31 77.19,31.62 77.04,31.47 77.04,14.25 77.04,13.26 77.04,8.76 v77.5,8.31 78.14,7.66 80.54,5.26 82.71,5.26 JST-XH1.P$6
N$24
  Top 0.406: JP2.2 41.66,36.55 R6.2
N$25
  Top 0.406: U4.20 60.2,23.54 60.43,23.54 60.81,23.16 60.81,16.38 63.09,14.1 C6.1
N$26
  Top 0.61: 31.7,41.72 RLY1.P$8 | RLY1.P$6 36.76,43.17 36.42,43.51 31.93,43.51 31.7,43.28 31.55,43.43 31.47,43.51 24.76,43.51 24.06,42.8 RLY1.P$10
  Top 1.016: F2.P$1 31.7,46.09 31.7,41.72 31.7,43.28 31.47,43.51
N$27
  Top 0.61: RLY1.P$5 36.76,35.55 38.18,34.14 38.3,34.01 JP2.1
N$28
  Top 0.813: L1.P$1 50.62,36.65 57.76,36.65 U6.8
  Top 1.016: L1.P$1 48.44,36.48 47.62,35.66 47.61,35.64 47.61,32.94 D2.1
N$29  (via drill 0.4)
  Top 0.406: U3.P$7 31.7,25.14 v31.55,25.3 | v35.51,26.75 35.97,26.75 37.19,27.97 37.19,28.47 R22.1
  Bottom 0.406: v31.55,25.3 31.55,25.68 32,26.14 34.9,26.14 v35.51,26.75
N$30
  Top 0.406: U3.P$6 34.79,25.79 35.13,25.45 35.13,24.31 35.43,24 36.27,23.16 36.27,22.99 R23.1
N$32
  Top 0.61: U1.P$2 65.82,37.66 C1.2
OUTA
  Top 0.254: U3.P$1 38.74,24.49 38.86,24.61 39.17,24.92 39.19,24.94 U5.4 42.47,24.94 42.67,25.15 42.67,27.31 R20.2
OUTB
  Top 0.254: U5.5 41.53,24.46 41.68,24.31 41.68,23.14 R21.2
  Top 0.305: U3.P$2 36.57,25.14 36.19,24.76 36.19,24.31 36.65,23.85 36.73,23.77 39.73,23.77 R21.2
PE  (via drill 0.4)
  Top 0.61: 23.09,46.56 F2.P$2 23.09,46.56 | 23.09,46.56 20.04,43.51 20.04,41.45 20.04,40.01 JP1.P$1 | 20.04,40.92 19.96,40.84 10.52,40.84 7.47,37.79 7.47,36.58 4.04,33.15 4.04,23.24 17.22,10.06 17.22,9.6 v17.3,9.52 | v17.3,15.85 19,15.85 JP1.P$13 | v17.3,41 15.55,41 JP1.P$2 | v17.3,34.75 19,34.75 JP1.P$3
  Top 1.016: 23.09,46.56 23.09,46.41 20.12,43.43 20.12,41.53 20.04,41.45 20.04,40.92 19.96,40.84
  Top 3.81: JP1.P$2 8.84,37.19 5.49,33.83 5.49,20.12 8.15,17.45 8.15,16.99 7.47,17.68 7.47,33.07 10.36,35.97 11.51,35.97 6.4,30.86 6.4,19.89 6.1,20.19 5.87,20.19 13.49,12.57 18.36,12.57 11.05,12.57 4.65,18.97 4.65,32.99 3.81,32.16 3.81,28.96 | 3.81,28.96 3.81,15.85 9.07,10.59 20.04,10.59 20.04,14.78 9.6,14.78 9.83,14.55 9.45,14.93 9.37,14.93 9.6,14.71 9.68,14.71 9.98,14.4 9.98,14.33 9.14,15.16 6.25,18.06 6.25,32.08 6.32,32.16 6.4,32.23 9.68,35.51 9.75,35.51 8.46,36.8 8.46,38.02 8.61,38.18 16.92,38.18 15.09,40 8.23,40 3.96,35.74 3.81,35.59 | 3.81,35.59 3.81,28.96 | 3.81,28.96 3.81,35.59 | 3.81,35.59 14.55,35.74 | 14.55,35.74 14.55,37.95 20.04,37.95 20.04,35.89 20.04,35.74 14.55,35.74 | 14.55,35.74 JP1.P$2 | JP1.P$2 JP1.P$1 | 20.04,40.01 20.04,35.81 JP1.P$3 | JP1.P$14 JP1.P$13 JP1.P$15
  Bottom 0.61: JST-XH2.P$7 82.81,37.79 83.9,37.79 85.42,36.27 85.42,4.8 85.19,4.57 83.3,2.68 JST-XH1.P$7 81.25,1.14 19.51,1.14 19.43,1.22 17.3,3.35 v17.3,9.52
  Bottom 3.81: JP1.P$2 JP1.P$4 | JP1.P$3 9.97,35.8 6.17,32 6.17,19.89 11.28,14.78 17.91,12.8 16.92,11.81 12.12,11.81 12.12,13.72 11.05,14.78 19.96,14.78 | 19.96,14.78 20.04,14.86 | 20.04,14.86 9.75,14.86 9.68,14.93 9.68,13.33 9.83,13.18 8.53,13.18 7.01,14.71 7.92,16 7.31,16 7.47,16.15 7.47,32.84 7.39,32.92 7.39,33.07 7.47,33.15 7.24,33.15 5.56,31.47 5.56,30.02 10.74,35.2 10.74,35.36 6.1,35.36 7.85,37.11 9.52,37.11 10.52,38.1 17.91,38.1 20.04,35.97 20.04,35.81 20.04,40.08 19.96,40 8.15,40 4.04,35.89 3.81,35.66 3.81,15.85 8.08,11.58 9.07,10.59 20.04,10.59 20.04,14.86 | 20.04,14.86 19.96,14.78 | 19.96,14.78 14.54,14.78 | 14.54,14.78 JP1.P$14 | 14.54,14.78 14.54,10.61 JP1.P$16
RESET  (via drill 0.4)
  Top 0.406: C5.2 R19.1 44.98,3.07 46.41,4.5 46.48,4.57 49.61,4.57 50.19,5.16 JP4.5 | U4.29 54.01,26.69 54.48,26.21 55.24,26.21 v55.24,21.49
  Top 0.61: SW1.P$2 SW1.P$3
  Bottom 0.406: SW1.P$3 60.41,3.89 52.58,3.89 51.71,4.75 JP4.5 53.42,6.86 53.42,7.47 58.52,12.57 58.6,12.57 58.6,14.93 58.06,15.47 56.62,15.47 56.62,17.45 56.62,17.91 56.39,18.14 55.7,18.14 55.24,18.59 v55.24,21.49
SCK  (via drill 0.5)
  Top 0.406: U4.17 58.52,21.14 58.6,21.07 v58.6,19.43
  Bottom 0.406: v58.6,19.43 57.61,18.44 57.61,16.69 57.99,16.31 59.28,16.31 59.59,16 59.59,12.19 58.67,11.28 54.25,6.86 JP4.3
VCC  (via drill 0.4)
  Top 0.406: v29.26,19.28 28.73,19.28 28.57,19.13 | v28.35,18.36 28.35,18.74 28.57,18.97 | U3.P$8 32.26,24.49 v31.39,23.62 32.54,22.48 32.61,22.4 R23.2
  Top 0.61: R1.P$2 26.29,23.01 27.74,24.46 27.81,24.54 30.48,24.54 v31.39,23.62
  Top 2.54: JP1.P$9 25.26,23.2 R1.P$2 23.23,22.17 15.47,22.17 14.48,23.16 25.3,23.16 27.13,21.34 28.35,21.34 28.57,21.11 28.57,19.13 28.57,18.97 14.48,18.97 14.48,22.1 14.63,22.25 14.78,22.25 16.61,20.42 26.67,20.42 27.05,20.04 27.74,20.04 28.65,19.13 28.65,22.48 JP1.P$11
  Bottom 0.61: v31.39,23.62 30.56,24.46 30.48,24.54 27.81,24.54 26.9,23.62 26.9,23.16 26.67,22.94
  Bottom 2.54: JP1.P$12 20.12,20.65 18.97,21.79 18.74,21.79 18.44,21.49 17.68,21.49 19.05,20.12 26.75,20.12 25.6,18.97 14.48,18.97 14.48,23.16 18.67,18.97 28.5,18.97 28.57,19.05 | 28.57,19.05 28.57,18.97 28.57,19.05 | 28.57,19.05 28.65,19.13 28.65,22.48 28.57,22.48 26.36,22.48 26.21,22.33 26.21,22.25 25.26,23.2 JP1.P$10 JP1.P$9 21.08,22.17 R1.P$2
VCC/2  (via drill 0.4)
  Top 0.406: v28.35,32.31 28.35,31.85 28.5,31.7 | 28.65,31.7 28.96,31.7 v29.26,31.39 | U3.P$5 32.08,26.44 v31.39,27.13 32.69,28.42 34.24,28.42 R22.2
  Top 0.61: R5.1 44.12,38.25 R6.1 | v31.39,27.13 30.48,26.21 27.81,26.21 26.59,27.43
  Top 0.813: R6.1 45.06,36.93 45.95,36.04 45.95,32.84 45.41,32.31 33.3,32.31 31.32,34.29
  Top 1.016: v28.35,32.31 29.34,32.31 31.32,34.29 31.62,34.59 31.62,36.57 RLY1.P$3
  Top 2.54: JP1.P$7 23.24,28.65 23.62,28.27 28.65,28.27 28.65,31.7 | 28.65,31.7 26.67,29.72 18.21,29.72 19.74,28.19 25.91,28.19 25.07,27.36 14.48,27.36 14.48,31.7 28.5,31.7 28.65,31.7 | 28.65,31.7 28.57,31.62 14.48,31.62 18.7,27.4 25.11,27.4 R2.P$1
  Bottom 0.61: R2.P$1 26.29,27.74 27.81,26.21 30.48,26.21 v31.39,27.13
  Bottom 2.54: R2.P$1 23.08,28.57 JP1.P$5 | JP1.P$5 JP1.P$7 | JP1.P$8 JP1.P$6 14.55,27.74 14.63,27.66 14.48,27.66 14.48,31.7 25.22,31.7 28.65,31.7 28.65,29.72 28.12,29.72 27.66,30.17 16.54,30.17 15.93,29.57 15.93,28.8 14.48,27.36 25.07,27.36 25.98,28.27 15.16,28.27 14.93,28.5 24.38,28.5 24.76,28.88 28.65,28.27 JP1.P$5
XTAL1  (via drill 0.5, 0.6)
  Top 0.406: U4.7 50.3,21.95 47.62,21.95 47.09,21.41 46.94,21.26 v46.94,20.95 | R24.2 53.37,14.71 53.03,14.71 51.66,13.33 51.13,12.8 51.13,11.99 C8.2 | C8.2 50.06,12.91 v50.06,13.64 | C8.2 52.76,10.21 55.09,10.21 56.06,9.24 XT1.P$3
  Bottom 0.406: v46.94,20.95 46.94,18.21 46.94,17.83 50.06,14.71 v50.06,13.64
XTAL2  (via drill 0.5, 0.6)
  Top 0.406: R24.1 56.26,15.47 55.32,16.41 v55.32,16.84 | R24.1 58.37,13.39 C7.2 | U4.8 48.43,21.15 v48.23,20.95 | 51.43,14.72 v51.43,14.86 | XT1.P$1 53.66,12.9 55.63,14.86 55.98,14.86 R24.1
  Bottom 0.406: v48.23,20.95 48.23,18.44 48.23,18.21 50.29,16.15 50.29,15.62 51.05,14.86 | 51.05,14.86 v51.43,14.86 | v51.43,14.86 54.33,14.86 54.86,15.39 55.32,15.85 v55.32,16.84 | v51.43,14.86 51.05,14.86

### Text on the board
tPlace: OUT - | OUT - | OUT + | OUT + | IN + | IN + | IN - | IN - | GND CTS +5V TXO RXI DTR
tNames: SCL SDA +5V GND | BBAUV PWR MONITORING BOARD ver 1.0A / Hoang The Huan / Jeremias Wong / / 30A CONT | 50A MAX